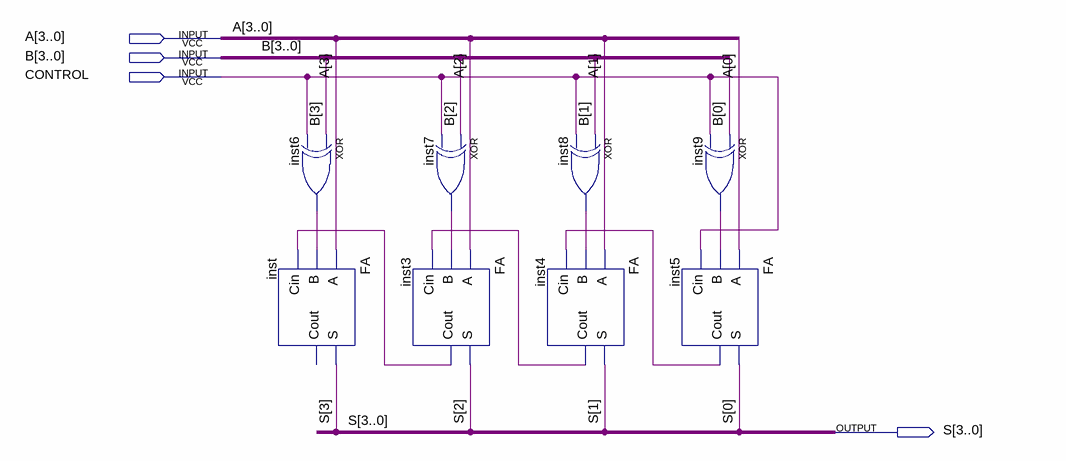
[diagram p0: schematic sheet]
// Quartus schematic CONGTRU4BIT.bdf as structural Verilog: 8 symbols, 4 pins
module CONGTRU4BIT (
  input  [3:0] A,
  input  [3:0] B,
  input  CONTROL,
  output [3:0] S
);

  wire inst3_cout, inst4_cout, inst5_cout, inst6_out, inst7_out, inst8_out, inst9_out;

  xor inst6 (inst6_out, B[3], CONTROL);
  FA inst (.A(A[3]), .B(inst6_out), .Cin(inst3_cout), .S(S[3]));  // open: Cout
  FA inst3 (.A(A[2]), .B(inst7_out), .Cin(inst4_cout), .S(S[2]), .Cout(inst3_cout));
  xor inst7 (inst7_out, B[2], CONTROL);
  xor inst8 (inst8_out, B[1], CONTROL);
  FA inst4 (.A(A[1]), .B(inst8_out), .Cin(inst5_cout), .S(S[1]), .Cout(inst4_cout));
  xor inst9 (inst9_out, B[0], CONTROL);
  FA inst5 (.A(A[0]), .B(inst9_out), .Cin(CONTROL), .S(S[0]), .Cout(inst5_cout));
endmodule
